# EAGLE design Guit2MIDI (EAGLE 9.2.0)
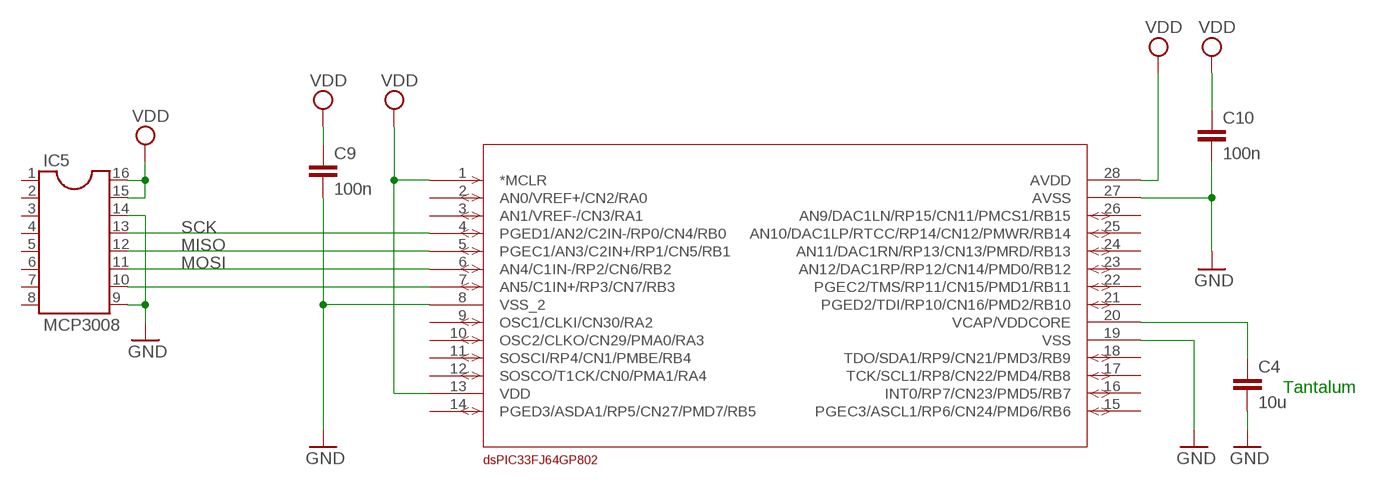
[diagram p0: schematic, sheet 1]

## Parts
C4  10u  C-EU025-030X050  [C025-030X050]
C9  100n  C-EU025-030X050  [C025-030X050]
C10  100n  C-EU025-030X050  [C025-030X050]
IC5  MCP3008  DIL16  [DIL16]
U3  DSPIC33FJ64GP802  [SPDIP28_300MC]

## Nets
GND: C4.2 C9.2 C10.2 IC5.9 IC5.14 U3.8(VSS_2) U3.19(VSS) U3.27(AVSS)
MISO: IC5.12 U3.5(PGEC1/AN3/C2IN+/RP1/CN5/RB1)
MOSI: IC5.11 U3.6(AN4/C1IN-/RP2/CN6/RB2)
N$2: IC5.10 U3.7(AN5/C1IN+/RP3/CN7/RB3)
N$19: C4.1 U3.20(VCAP/VDDCORE)
SCK: IC5.13 U3.4(PGED1/AN2/C2IN-/RP0/CN4/RB0)
VDD: C9.1 C10.1 IC5.15 IC5.16 U3.1(*MCLR) U3.13(VDD) U3.28(AVDD)
Unconnected: IC5.1 IC5.2 IC5.3 IC5.4 IC5.5 IC5.6 IC5.7 IC5.8 U3.2(AN0/VREF+/CN2/RA0) U3.3(AN1/VREF-/CN3/RA1) U3.9(OSC1/CLKI/CN30/RA2) U3.10(OSC2/CLKO/CN29/PMA0/RA3) U3.11(SOSCI/RP4/CN1/PMBE/RB4) U3.12(SOSCO/T1CK/CN0/PMA1/RA4) U3.14(PGED3/ASDA1/RP5/CN27/PMD7/RB5) U3.15(PGEC3/ASCL1/RP6/CN24/PMD6/RB6) U3.16(INT0/RP7/CN23/PMD5/RB7) U3.17(TCK/SCL1/RP8/CN22/PMD4/RB8) U3.18(TDO/SDA1/RP9/CN21/PMD3/RB9) U3.21(PGED2/TDI/RP10/CN16/PMD2/RB10) U3.22(PGEC2/TMS/RP11/CN15/PMD1/RB11) U3.23(AN12/DAC1RP/RP12/CN14/PMD0/RB12) U3.24(AN11/DAC1RN/RP13/CN13/PMRD/RB13) U3.25(AN10/DAC1LP/RTCC/RP14/CN12/PMWR/RB14) U3.26(AN9/DAC1LN/RP15/CN11/PMCS1/RB15)

## Notes on the sheet
- Tantalum

## Library data of the parts
C4 C9 C10 = resistor:C-EU: CAPACITOR, European symbol
IC5 = ic-package:DIL16: Dual In Line / Socket
U3 = dsPIC33FJ64GP802:DSPIC33FJ64GP802

## Board
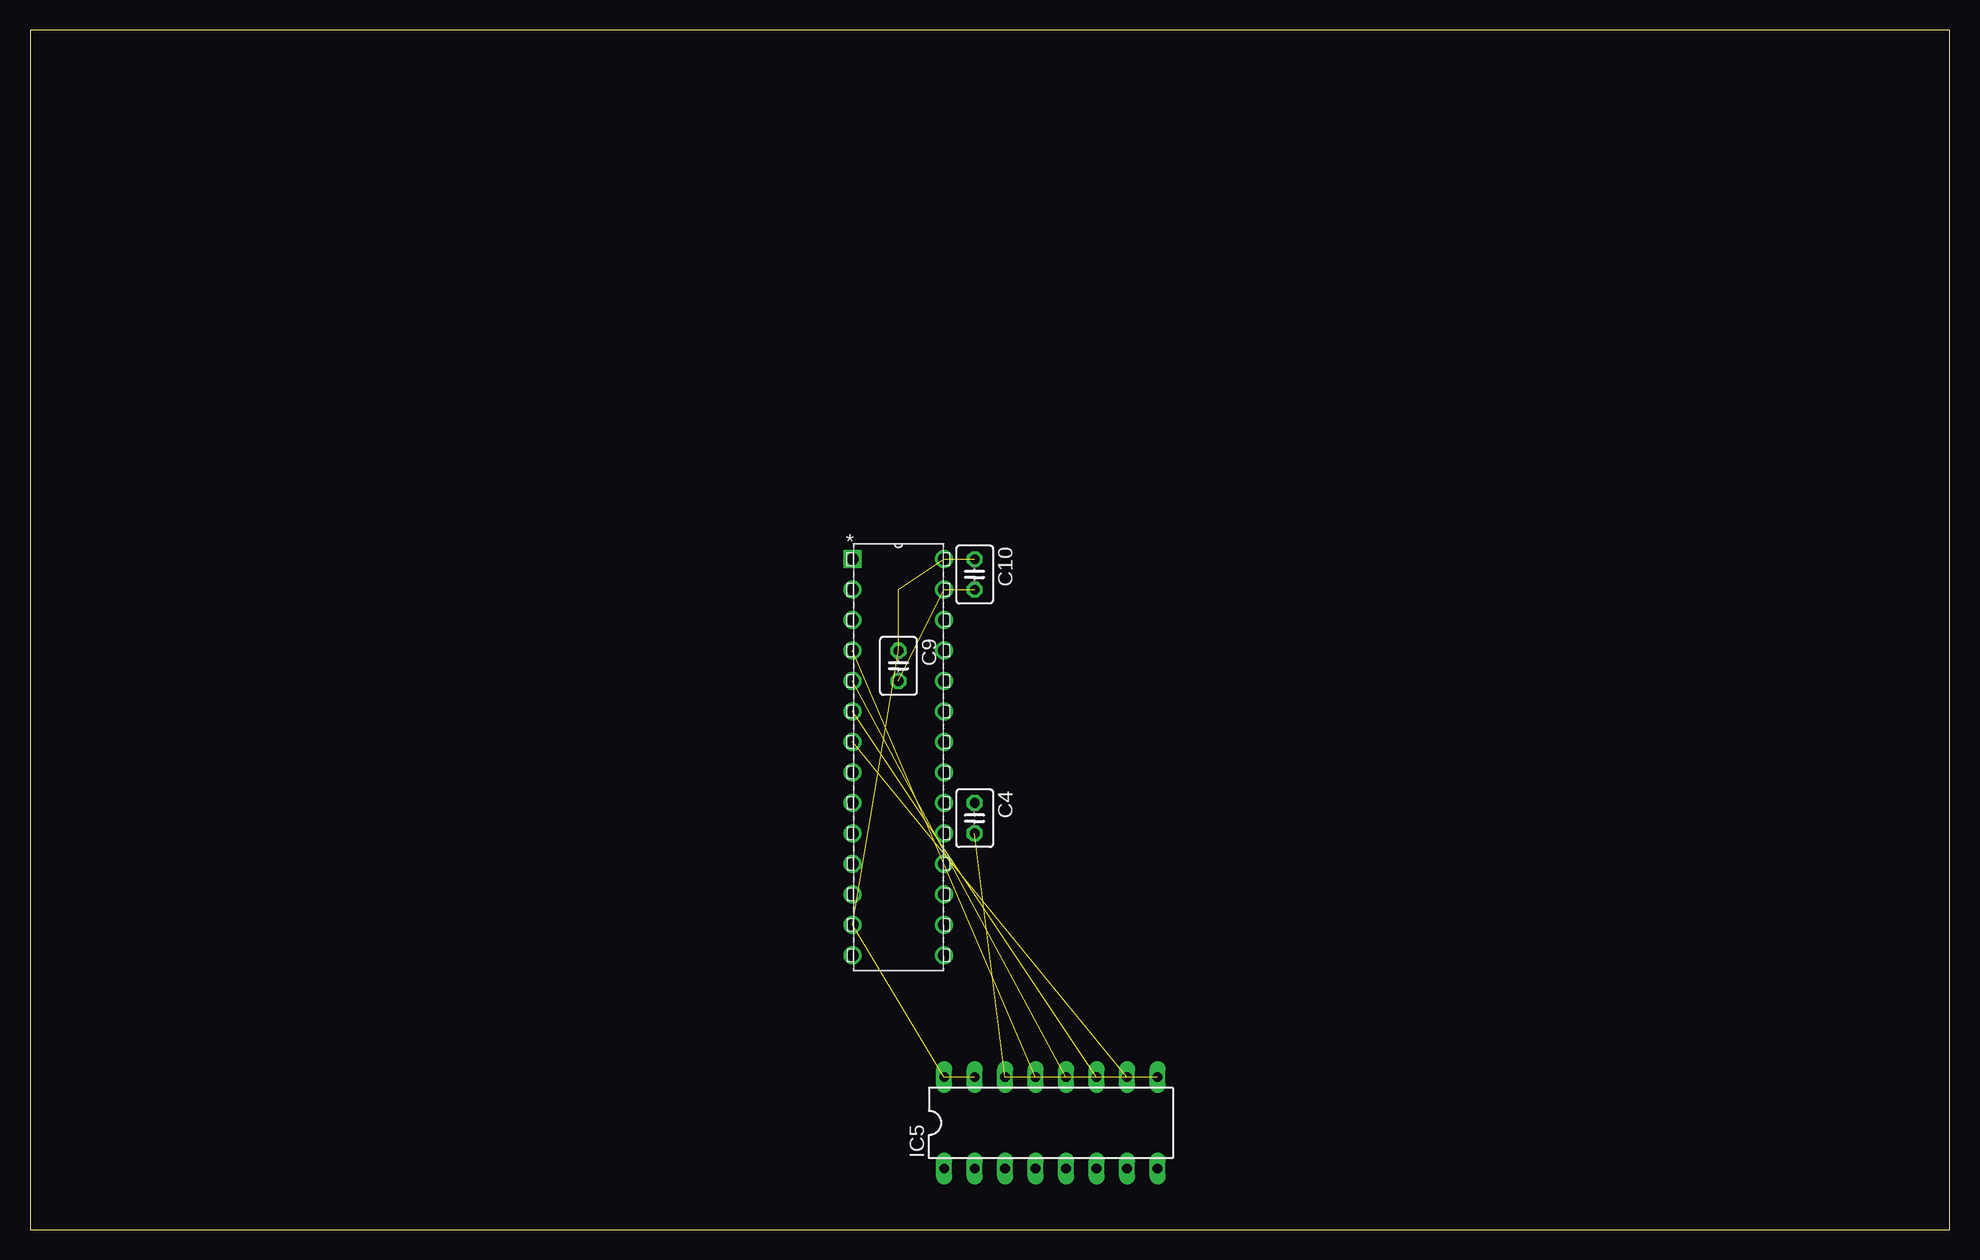
[diagram p1: board, top side]
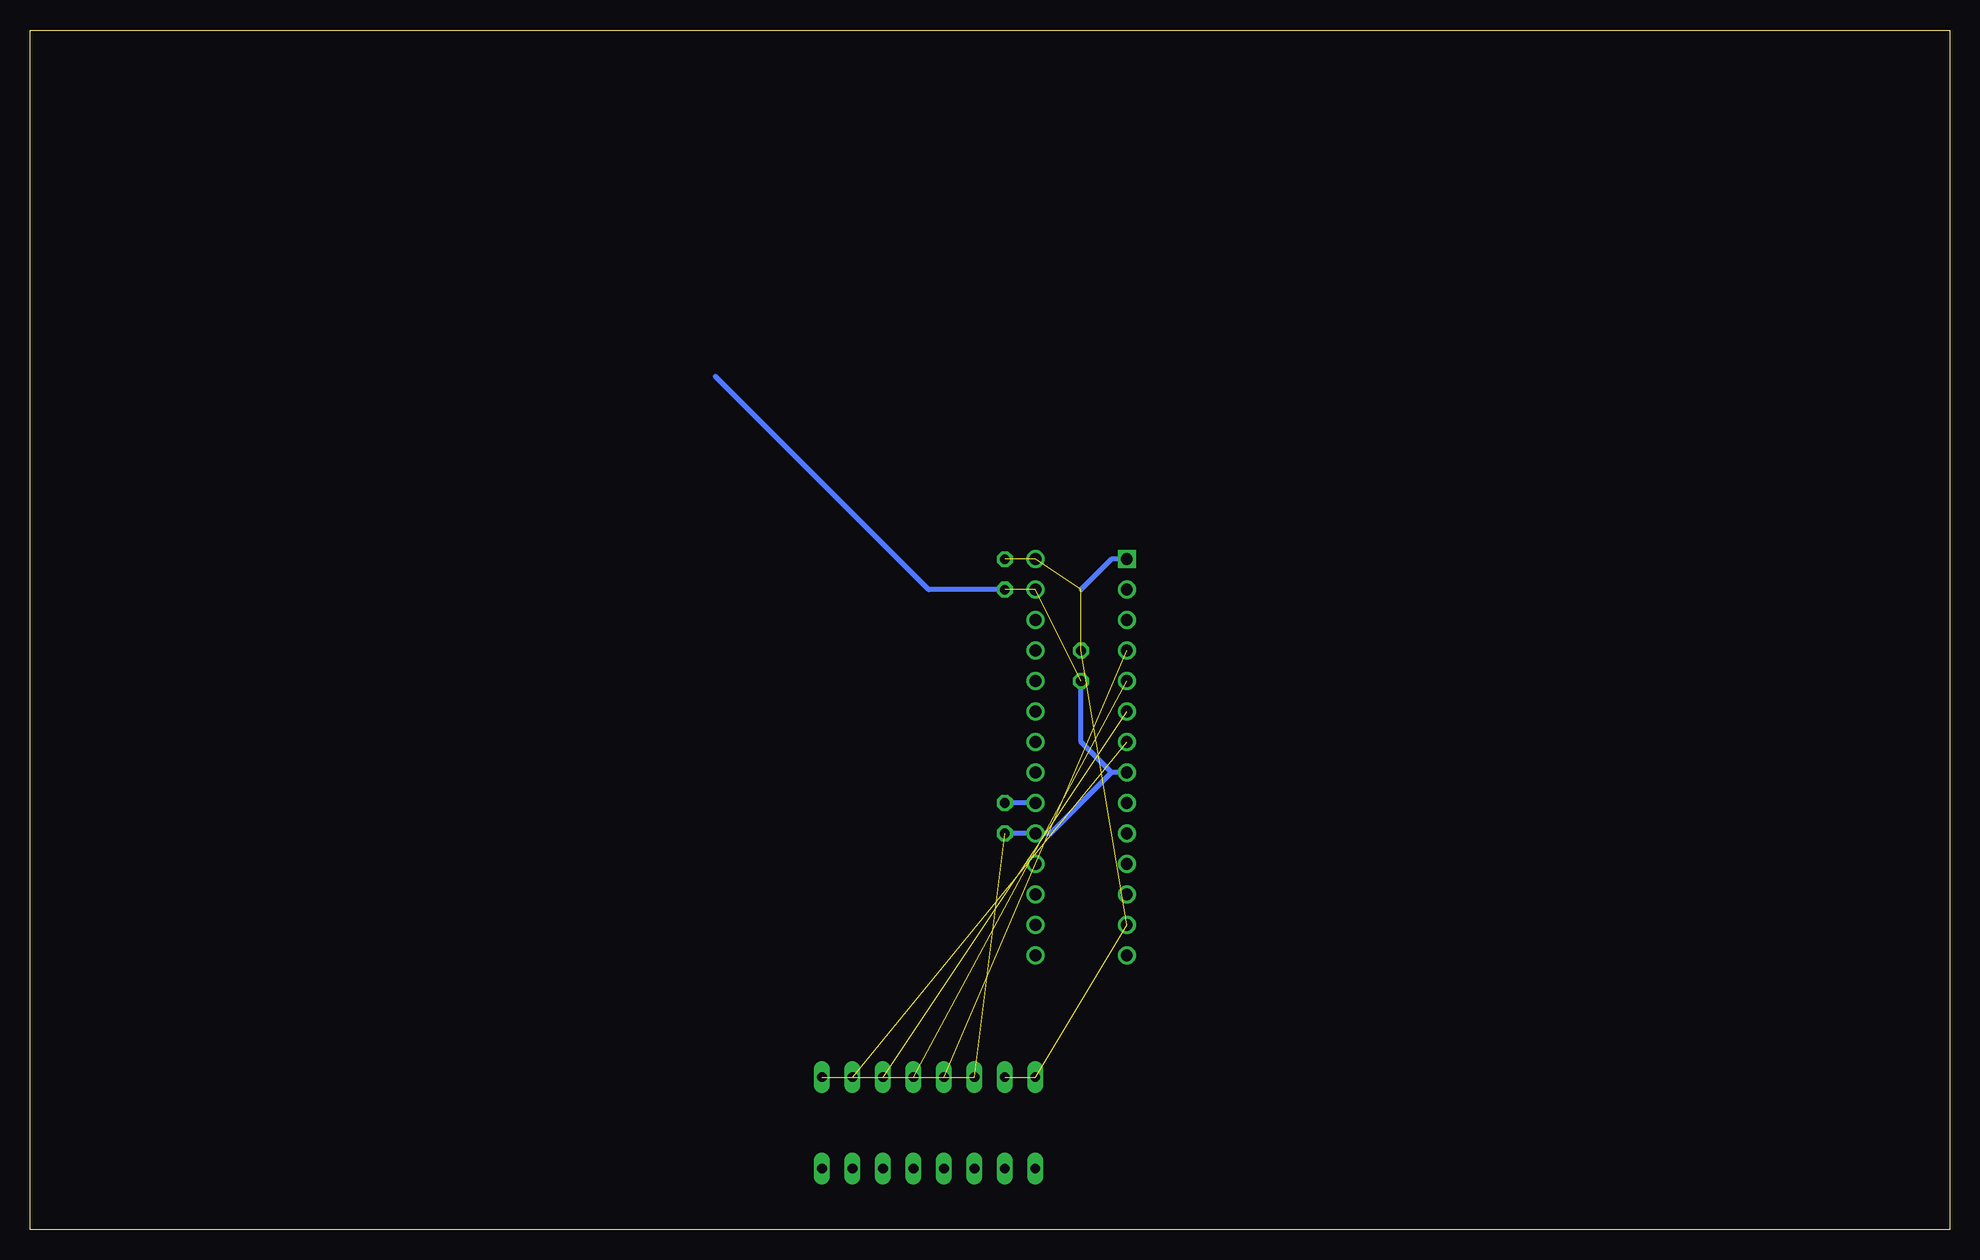
[diagram p2: board, bottom side, seen from below]

Size 160 x 100 mm. Coordinates in mm from the lower left corner, seen from the top.
Outline: 0,0 160,0 160,100 0,100 0,0
Copper layers (1*16): Top 0.035mm / dielectric 1.5mm / Bottom 0.035mm
Design rules "default": minimum track width 10mil, minimum drill 24mil, track to track 8mil, track to pad 8mil, pad to pad 8mil, via to via 8mil, smd to smd 8mil, copper to edge 40mil, drill to drill 8mil, minimum pad ring 10mil, minimum via ring 8mil, stop-mask expansion 4mil, vias tented up to drill 0mil, thermal gap 10mil

### Footprints (pad centres in the part's own frame; a part is rotated, then mirrored left to right if it is on the bottom)
C025-030X050 = drill 0.813 octagon: 1 -1.27,0; 2 1.27,0
DIL16 = drill 0.813 long: 1 -8.89,-3.81; 2 -6.35,-3.81; 3 -3.81,-3.81; 4 -1.27,-3.81; 5 1.27,-3.81; 6 3.81,-3.81; 7 6.35,-3.81; 8 8.89,-3.81; 9 8.89,3.81; 10 6.35,3.81; 11 3.81,3.81; 12 1.27,3.81; 13 -1.27,3.81; 14 -3.81,3.81; 15 -6.35,3.81; 16 -8.89,3.81
SPDIP28_300MC = drill 0.991 square: 1 -7.62,33.02 | drill 0.991: 2 -7.62,30.48; 3 -7.62,27.94; 4 -7.62,25.4; 5 -7.62,22.86; 6 -7.62,20.32; 7 -7.62,17.78; 8 -7.62,15.24; 9 -7.62,12.7; 10 -7.62,10.16; 11 -7.62,7.62; 12 -7.62,5.08; 13 -7.62,2.54; 14 -7.62,0; 15 0,0; 16 0,2.54; 17 0,5.08; 18 0,7.62; 19 0,10.16; 20 0,12.7; 21 0,15.24; 22 0,17.78; 23 0,20.32; 24 0,22.86; 25 0,25.4; 26 0,27.94; 27 0,30.48; 28 0,33.02

### Placement (x,y rotation side)
C4  78.74,34.29 270 top
C9  72.39,46.99 270 top
C10  78.74,54.61 270 top
IC5  85.09,8.89 0 top
U3  76.2,22.86 0 top

### Tracks (layer width: path | path; a pad name or v marks a point on that pad's centre or on a via)
GND  (4 unrouted)
  Bottom 0.406: U3.8 69.85,38.1 | 69.85,38.1 74.93,33.02 U3.19 C4.2 | C9.2 72.39,40.64 69.85,38.1 | C10.2 85.09,53.34 102.87,71.12
MISO  (1 unrouted)
MOSI  (1 unrouted)
N$2  (1 unrouted)
N$19
  Bottom 0.406: U3.20 C4.1
SCK  (1 unrouted)
VDD  (6 unrouted)
  Bottom 0.406: 72.39,53.34 69.85,55.88 U3.1